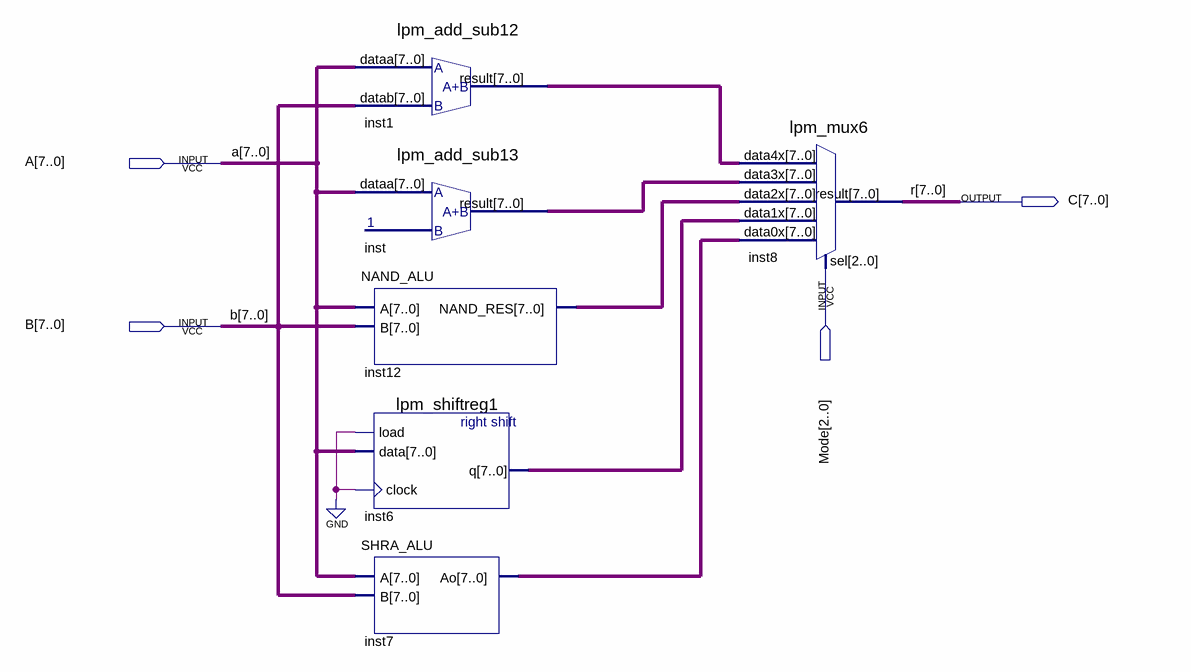
[diagram p0: schematic sheet]
// Quartus schematic TRUE_ALU_V3.bdf as structural Verilog: 6 symbols, 4 pins
module TRUE_ALU_V3 (
  input  [7:0] A,
  input  [2:0] Mode,
  input  [7:0] B,
  output [7:0] C
);

  wire [7:0] inst1_result, inst6_q, inst7_ao, inst12_nand_res, inst_result;

  lpm_add_sub12 inst1 (.dataa(A), .datab(B), .result(inst1_result));
  lpm_add_sub13 inst (.dataa(A), .result(inst_result));
  NAND_ALU inst12 (.A(A), .B(B), .NAND_RES(inst12_nand_res));
  lpm_shiftreg1 inst6 (.load(1'b0), .data(A), .clock(1'b0), .q(inst6_q));
  SHRA_ALU inst7 (.A(A), .B(B), .Ao(inst7_ao));
  lpm_mux6 inst8 (
    .data4x(inst1_result), .data3x(inst_result), .data2x(inst12_nand_res), .data1x(inst6_q),
    .data0x(inst7_ao), .sel(Mode), .result(C));

  // Other names for the same wires on the sheet: r[7:0] = C
endmodule
